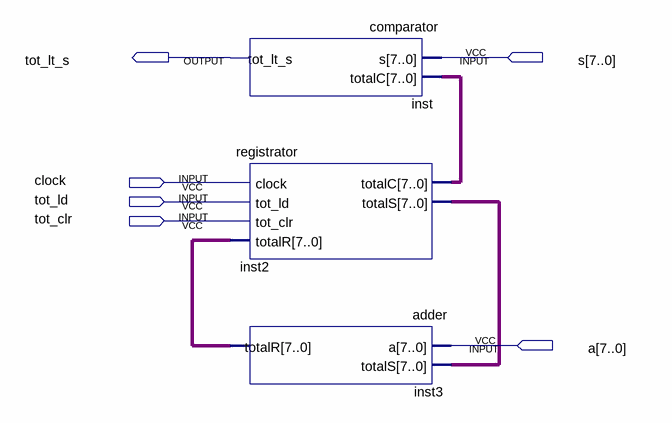
[diagram p0: schematic sheet]
// Quartus schematic operational.bdf as structural Verilog: 3 symbols, 6 pins
module operational (
  input  [7:0] s,
  input  clock,
  input  tot_ld,
  input  tot_clr,
  input  [7:0] a,
  output tot_lt_s
);

  wire [7:0] inst2_totalc, inst2_totals, inst3_totalr;

  comparator inst (.s(s), .totalC(inst2_totalc), .tot_lt_s(tot_lt_s));
  registrator inst2 (
    .clock(clock), .tot_ld(tot_ld), .tot_clr(tot_clr), .totalR(inst3_totalr), .totalC(inst2_totalc),
    .totalS(inst2_totals));
  adder inst3 (.a(a), .totalS(inst2_totals), .totalR(inst3_totalr));
endmodule
